# Altium project KeetV2.PrjPCB (part 2 of 6)
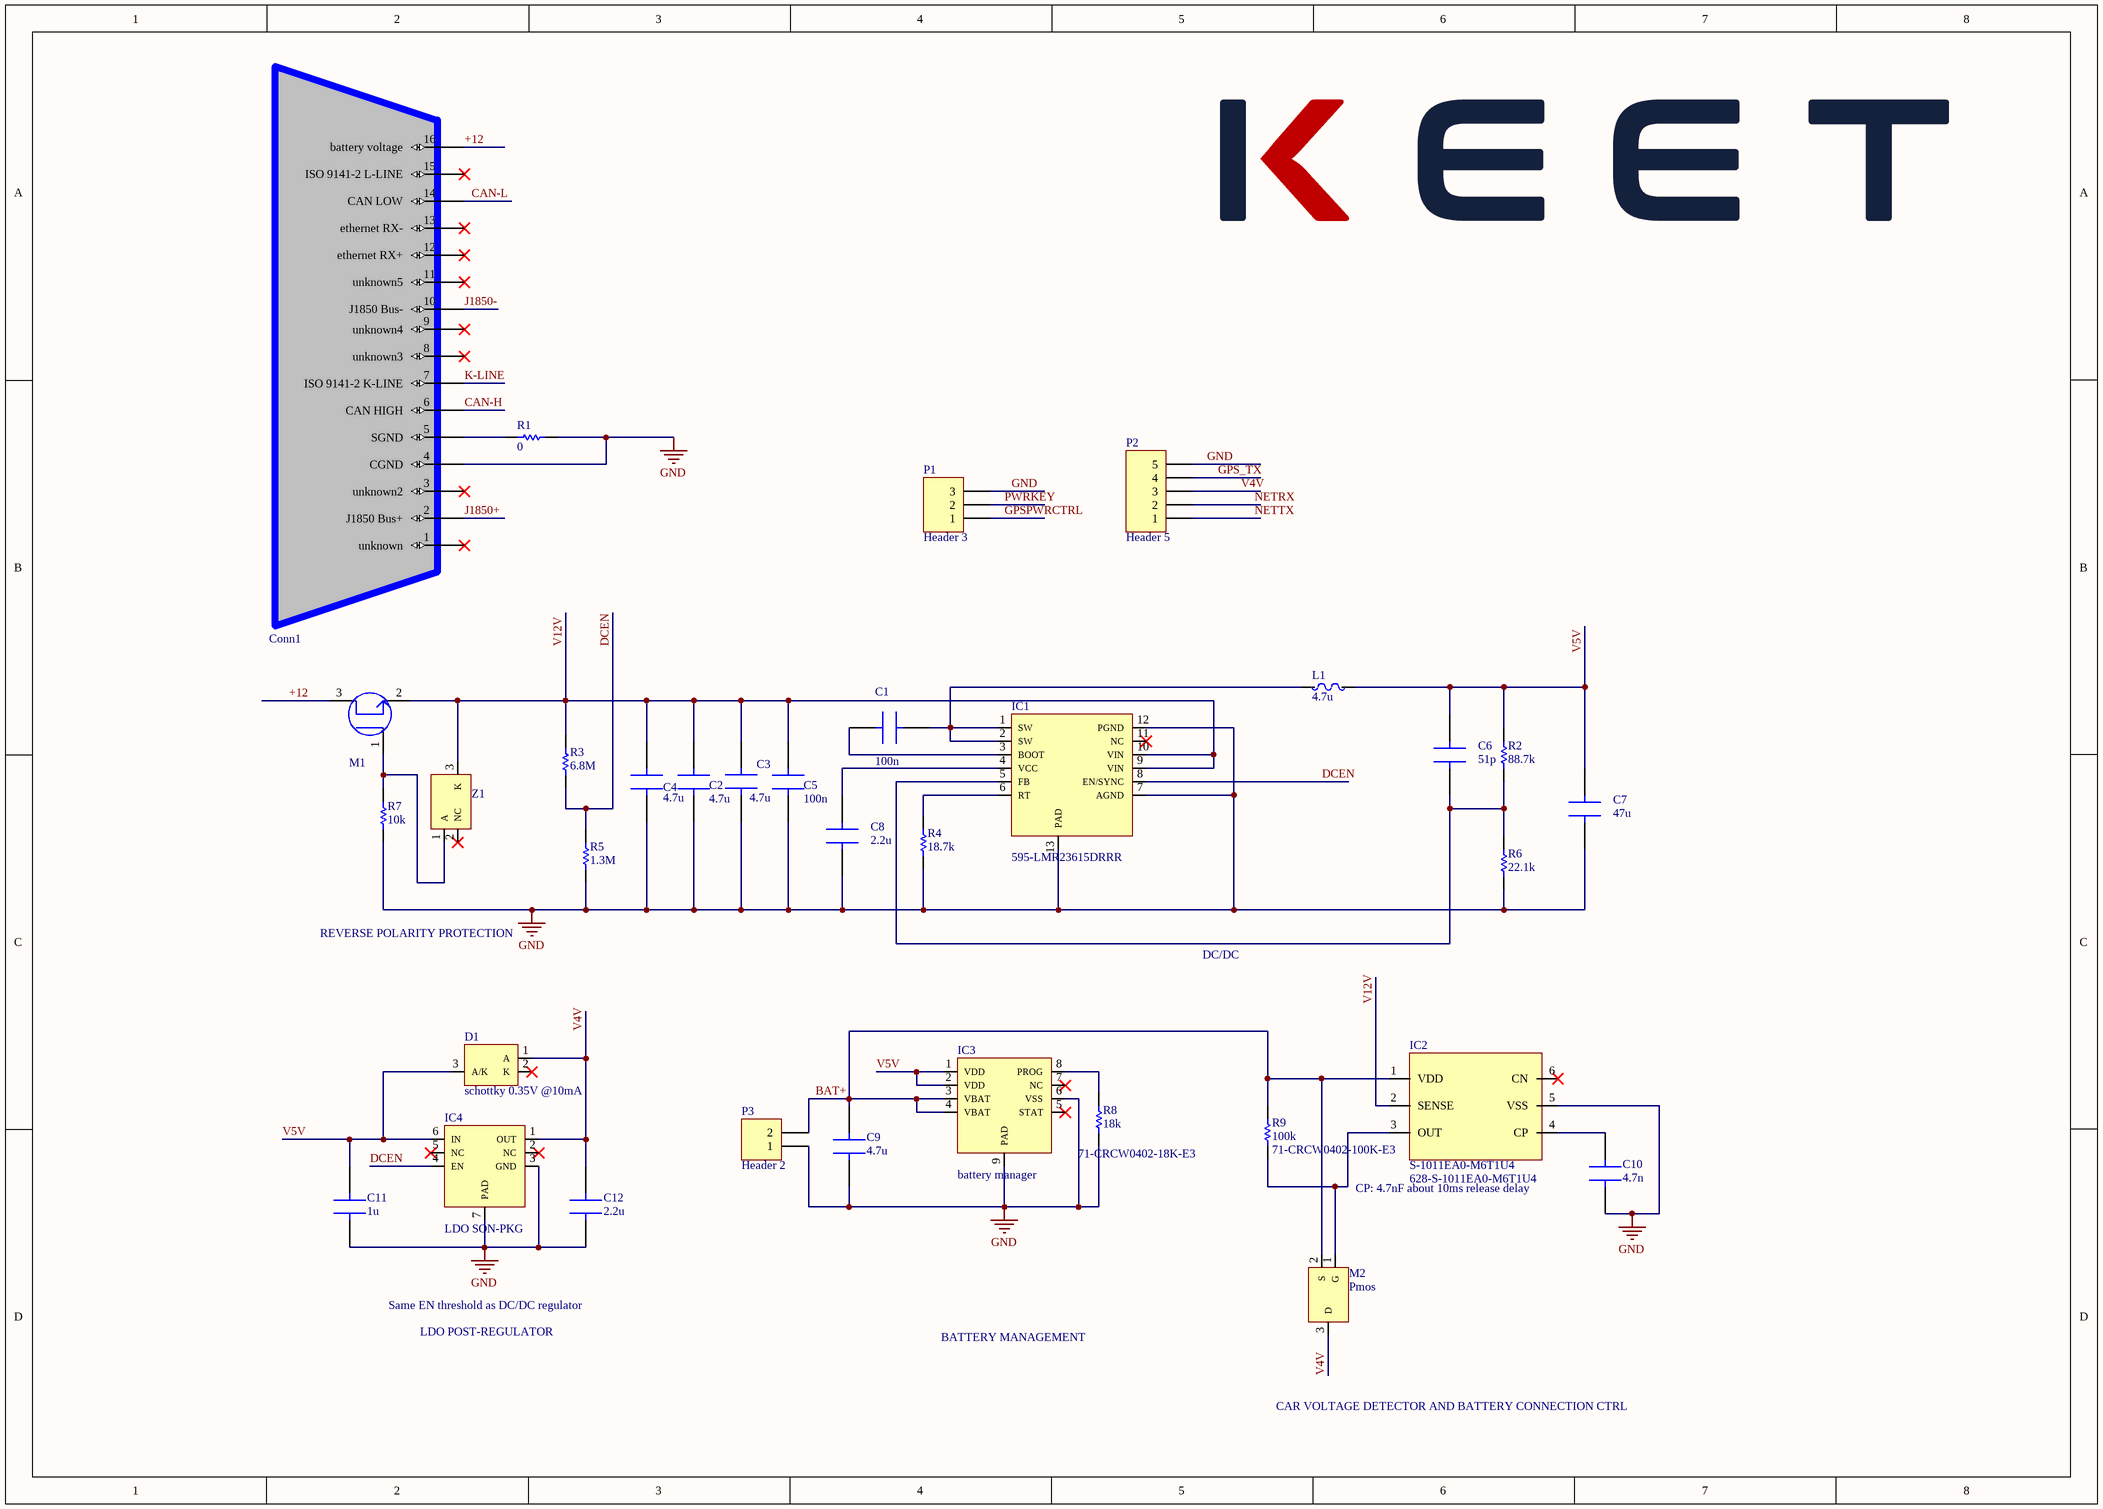
[diagram p3: PowerSupply.SchDoc]

## Sheet PowerSupply.SchDoc (continued)
### Library data of the parts
C1 = GRM155R71C104KA88D: CAP CER 0.1UF 16V X7R 0402; Manufacturer: Murata; Material: Ceramic; Capacitance: 100nF; Tolerance: 10%; Insulation Resistance: 10GR; Supplier 1: Mouser; Manufacturer Part Number: GRM155R71C104KA88D; RoHS: Yes; Category: Ceramic Capacitors; Stock 1: 8059685; Pricing 1: 1=0,10000, 10=0,01200, 50=0,01200, 100=0,01000, 1000=0,00600, 10000=0,00300 (USD); Mount: Surface Mount; Case/Package: 0402; Number of Pins: 2; Case Code (Metric): 1005; Case Code (Imperial): 0402; Dielectric Material: Ceramic; Min Operating Temperature: -55°C; Max Operating Temperature: 125°C; Dielectric: X7R; Voltage Rating: 16V; Packaging: Tape and Reel; Voltage Rating (DC): 16V; Package Quantity: 1; Termination: SMD/SMT; Voltage: 16V; Length: 1mm; Width: 0.5mm; Height: 0.5mm; Thickness: 0.022inch; Depth: 0.5mm; Radiation Hardening: No; REACH SVHC: No SVHC; Lead Free: Lead Free; RoHS Compliant: Yes; ComponentLink1URL: https://datasheet.ciiva.com/18102/getdatasheetpartid-85307-18102905.pdf?src-supplier=Verical; ComponentLink1Description: https://datasheet.ciiva.com/18102/getdatasheetpartid-85307-18102905.pdf?src-supplier=Verical; ComponentLink2URL: https://datasheet.ciiva.com/129/grm155r71c104ka88-01-129739.pdf?src-supplier=Digi-Key; ComponentLink2Description: https://datasheet.ciiva.com/129/grm155r71c104ka88-01-129739.pdf?src-supplier=Digi-Key; ComponentLink3URL: https://datasheet.ciiva.com/129/grm155r71c104ka88-01-129740.pdf?src-supplier=Digi-Key; ComponentLink3Description: https://datasheet.ciiva.com/129/grm155r71c104ka88-01-129740.pdf?src-supplier=Digi-Key; ComponentLink4URL: https://datasheet.ciiva.com/29199/454098-da-01-en-vs-kondensator-0402-29199799.pdf?src-supplier=Conrad; ComponentLink4Description: https://datasheet.ciiva.com/29199/454098-da-01-en-vs-kondensator-0402-29199799.pdf?src-supplier=Conrad; ComponentLink5URL: https://datasheet.ciiva.com/28534/4360-28534133.pdf?src-supplier=Element14; ComponentLink5Description: https://datasheet.ciiva.com/28534/4360-28534133.pdf?src-supplier=Element14; ComponentLink6URL: https://datasheet.ciiva.com/14103/grmseries-highdielectrictype-eng-14103750.pdf?src-supplier=Distrelec; ComponentLink6Description: https://datasheet.ciiva.com/14103/grmseries-highdielectrictype-eng-14103750.pdf?src-supplier=Distrelec; ComponentLink7URL: https://datasheet.ciiva.com/16199/product-16199000.pdf?src-supplier=Future+Electronics; ComponentLink7Description: https://datasheet.ciiva.com/16199/product-16199000.pdf?src-supplier=Future+Electronics; ComponentLink8URL: https://datasheet.ciiva.com/14116/grmseries-highdielectrictype-eng-14116878.pdf?src-supplier=Distrelec; ComponentLink8Description: https://datasheet.ciiva.com/14116/grmseries-highdielectrictype-eng-14116878.pdf?src-supplier=Distrelec; ComponentLink9URL: https://datasheet.ciiva.com/7937/4360-7937615.pdf?src-supplier=Element14; ComponentLink9Description: https://datasheet.ciiva.com/7937/4360-7937615.pdf?src-supplier=Element14; ComponentLink10URL: https://datasheet.ciiva.com/28534/4360-28534127.pdf?src-supplier=Element14; ComponentLink10Description: https://datasheet.ciiva.com/28534/4360-28534127.pdf?src-supplier=Element14; Supplier Part Number 1: 81-GRM155R71C104KA88
C2-C4 = TMK107BBJ475MA-T: Cap Ceramic 4.7uF 25V X5R 20% SMD 0603 85°C Paper T/R; Manufacturer: Taiyo Yuden; Supplier 1: Mouser; Manufacturer Part Number: TMK107BBJ475MA-T; RoHS: Yes; Category: Ceramic Capacitors; Stock 1: 24308; Pricing 1: 1=0,35000, 10=0,15700, 50=0,15700, 100=0,10600, 1000=0,08200, 10000=0,06300 (USD); Mount: Surface Mount; Case/Package: 0603; Min Operating Temperature: -55°C; Max Operating Temperature: 85°C; Packaging: Tape and Reel; Capacitance: 4.7uF; Tolerance: 20%; Voltage Rating: 25V; RoHS Compliant: Yes; ComponentLink1URL: https://ds.yuden.co.jp/TYCOMPAS/ut/detail?pn=TMK107BBJ475MA-T &amp;u=M&src-supplier=Digi-Key; ComponentLink1Description: https://ds.yuden.co.jp/TYCOMPAS/ut/detail?pn=TMK107BBJ475MA-T &amp;u=M&src-supplier=Digi-Key; Supplier Part Number 1: 963-TMK107BBJ475MA-T
C5 = C1005X5R1H104K050BB: CAP CER 0.1UF 50V X5R 0402; Manufacturer: TDK; Dielectric Material: Ceramic; Capacitance: 100nF; Tolerance: 10%; Supplier 1: Mouser; Manufacturer Part Number: C1005X5R1H104K050BB; RoHS: Yes; Category: Ceramic Capacitors; Stock 1: 364267; Pricing 1: 1=0,12000, 10=0,04700, 50=0,04700, 100=0,03200, 1000=0,02200, 10000=0,01400 (USD); Mount: Surface Mount; Case/Package: 0402; Case Code (Metric): 1005; Case Code (Imperial): 0402; Weight: 2.3E-05oz; Min Operating Temperature: -55°C; Max Operating Temperature: 85°C; Dielectric: X5R; Voltage Rating: 50V; Packaging: Tape and Reel; Voltage Rating (DC): 50V; Termination: SMD/SMT; Package Quantity: 1; Resistor Type: Ceramic; Voltage: 50V; Series: C; Construction: Flat; Length: 1mm; Width: 0.02inch; Height: 0.5mm; Depth: 0.5mm; Thickness: 0.022inch; Radiation Hardening: No; Lead Free: Lead Free; REACH SVHC: No SVHC; RoHS Compliant: Yes; ComponentLink1URL: https://datasheet.ciiva.com/26946/getdatasheetpartid-743571-26946503.pdf?src-supplier=Verical; ComponentLink1Description: https://datasheet.ciiva.com/26946/getdatasheetpartid-743571-26946503.pdf?src-supplier=Verical; ComponentLink2URL: https://datasheet.ciiva.com/6292/tdkmlcccaprange-6292486.pdf?src-supplier=Digi-Key; ComponentLink2Description: https://datasheet.ciiva.com/6292/tdkmlcccaprange-6292486.pdf?src-supplier=Digi-Key; ComponentLink3URL: https://datasheet.ciiva.com/16494/e413-c-16494264.pdf?src-supplier=Future+Electronics; ComponentLink3Description: https://datasheet.ciiva.com/16494/e413-c-16494264.pdf?src-supplier=Future+Electronics; ComponentLink4URL: https://datasheet.ciiva.com/17487/e412-c-17487567.pdf?src-supplier=Avnet+Europe; ComponentLink4Description: https://datasheet.ciiva.com/17487/e412-c-17487567.pdf?src-supplier=Avnet+Europe; Supplier Part Number 1: 810-C1005X5R1H104K
C6 = GRM1555C1H510JA01D: CAP CER 51PF 50V C0G/NP0 0402; Manufacturer: Murata; Tolerance: 5%; Dielectric: C0G; Supplier 1: Mouser; Manufacturer Part Number: GRM1555C1H510JA01D; RoHS: Yes; Category: Ceramic Capacitors; Stock 1: 25277; Pricing 1: 1=0,10000, 10=0,06000, 50=0,06000, 100=0,02600, 1000=0,01400, 10000=0,01100 (USD); Mount: Surface Mount; Case/Package: 0402; Case Code (Metric): 1005; Case Code (Imperial): 0402; Min Operating Temperature: -55°C; Max Operating Temperature: 125°C; Capacitance: 51pF; Packaging: Tape and Reel; Voltage Rating: 50V; Package Quantity: 10000; Voltage Rating (DC): 50V; Termination: SMD/SMT; Voltage: 50V; Length: 1mm; Width: 0.02inch; Height: 0.5mm; Thickness: 0.022inch; Depth: 0.5mm; Radiation Hardening: No; Lead Free: Lead Free; ComponentLink1URL: https://datasheet.ciiva.com/11606/product-11606259.pdf?src-supplier=Avnet; ComponentLink1Description: https://datasheet.ciiva.com/11606/product-11606259.pdf?src-supplier=Avnet; ComponentLink2URL: https://datasheet.ciiva.com/6263/grm1555c1h510ja01-01-6263865.pdf?src-supplier=Digi-Key; ComponentLink2Description: https://datasheet.ciiva.com/6263/grm1555c1h510ja01-01-6263865.pdf?src-supplier=Digi-Key; ComponentLink3URL: https://datasheet.ciiva.com/6263/partnumbering-e-01-6263868.pdf?src-supplier=Digi-Key; ComponentLink3Description: https://datasheet.ciiva.com/6263/partnumbering-e-01-6263868.pdf?src-supplier=Digi-Key; ComponentLink4URL: https://datasheet.ciiva.com/6263/partnumbering-e-01-6263870.pdf?src-supplier=Digi-Key; ComponentLink4Description: https://datasheet.ciiva.com/6263/partnumbering-e-01-6263870.pdf?src-supplier=Digi-Key; Supplier Part Number 1: 81-GRM1555C1H510JA1D
C7 = GRM31CR61A476KE15L: Multilayer Ceramic Capacitors MLCC - SMD/SMT 1206 47uF 10Vdc X5R +/-10%; Manufacturer: Murata; Voltage: 10V; Tolerance: 10%; Supplier 1: Mouser; Manufacturer Part Number: GRM31CR61A476KE15L; RoHS: Yes; Category: Ceramic Capacitors; Stock 1: 61980; Pricing 1: 1=0,67000, 10=0,40500, 50=0,40500, 100=0,35300, 1000=0,23900, 10000=0,19100 (USD); Mount: Surface Mount; Case/Package: 1206; Material: Ceramic; Case Code (Metric): 3216; Case Code (Imperial): 1206; Min Operating Temperature: -55°C; Max Operating Temperature: 85°C; Termination: SMD/SMT; Dielectric: X5R; Package Quantity: 2000; Packaging: Tape and Reel; Capacitance: 47uF; Voltage Rating: 10V; Voltage Rating (DC): 10V; Length: 3.2mm; Width: 1.6mm; Height: 1.6mm; Thickness: 0.071inch; Depth: 1.6mm; Lead Free: Lead Free; REACH SVHC: No SVHC; ComponentLink1URL: https://datasheet.ciiva.com/29536/grm31cr61a476ke15-01-29536840.pdf?src-supplier=Digi-Key; ComponentLink1Description: https://datasheet.ciiva.com/29536/grm31cr61a476ke15-01-29536840.pdf?src-supplier=Digi-Key; ComponentLink2URL: https://datasheet.ciiva.com/13337/product-13337807.pdf?src-supplier=Mouser; ComponentLink2Description: https://datasheet.ciiva.com/13337/product-13337807.pdf?src-supplier=Mouser; ComponentLink3URL: https://datasheet.ciiva.com/46445/1769893-46445004.pdf?src-supplier=Element14; ComponentLink3Description: https://datasheet.ciiva.com/46445/1769893-46445004.pdf?src-supplier=Element14; ComponentLink4URL: https://datasheet.ciiva.com/41860/partnumbering-e-01-41860758.pdf?src-supplier=Digi-Key; ComponentLink4Description: https://datasheet.ciiva.com/41860/partnumbering-e-01-41860758.pdf?src-supplier=Digi-Key; ComponentLink5URL: https://datasheet.ciiva.com/46445/1769893-46445005.pdf?src-supplier=Element14; ComponentLink5Description: https://datasheet.ciiva.com/46445/1769893-46445005.pdf?src-supplier=Element14; Supplier Part Number 1: 81-GRM31CR61A476KE5L
C8 = CL10A225KP8NNNC: SAMSUNG ELECTRO-MECHANICS - CL10A225KP8NNNC - SMD Multilayer Ceramic Capacitor, 2.2 µF, 10 V, 0603 [1608 Metric], ± 10%, X5R, CL Series; Capacitance: 2.2uF; Voltage Rating: 10V; Supplier 1: Mouser; Manufacturer: Samsung; Manufacturer Part Number: CL10A225KP8NNNC; RoHS: Yes; Category: Ceramic Capacitors; Stock 1: 629992; Pricing 1: 1=0,10000, 10=0,03100, 50=0,03100, 100=0,02500, 1000=0,01400, 10000=0,00900 (USD); Mount: Surface Mount; Case/Package: 0603; Case Code (Metric): 1608; Case Code (Imperial): 0603; Material: Ceramic; Min Operating Temperature: -55°C; Max Operating Temperature: 85°C; Tolerance: 10%; Dielectric: X5R; Package Quantity: 1; Packaging: Tape and Reel; Voltage: 10V; Series: CL; Construction: Flat; Voltage Rating (DC): 10V; Length: 1.6mm; Width: 0.031inch; Height: 0.8mm; Thickness: 0.035inch; Depth: 0.8mm; Radiation Hardening: No; RoHS Compliant: Yes; Lead Free: Lead Free; ComponentLink1URL: https://datasheet.ciiva.com/25799/cl10a225kp8nnnc-25799697.pdf?src-supplier=Digi-Key; ComponentLink1Description: https://datasheet.ciiva.com/25799/cl10a225kp8nnnc-25799697.pdf?src-supplier=Digi-Key; ComponentLink2URL: https://datasheet.ciiva.com/26838/getdatasheetpartid-358617-26838359.pdf?src-supplier=Verical; ComponentLink2Description: https://datasheet.ciiva.com/26838/getdatasheetpartid-358617-26838359.pdf?src-supplier=Verical; ComponentLink3URL: https://datasheet.ciiva.com/29198/457945-da-01-en-vs-kondensator-0603-29198592.pdf?src-supplier=Conrad; ComponentLink3Description: https://datasheet.ciiva.com/29198/457945-da-01-en-vs-kondensator-0603-29198592.pdf?src-supplier=Conrad; Supplier Part Number 1: 187-CL10A225KP8NNNC
C9 = GRM155R60J475ME87D: MURATA - GRM155R60J475ME87D - SMD Multilayer Ceramic Capacitor, 4.7 µF, 6.3 V, 0402 [1005 Metric], ± 20%, X5R, GRM Series; Capacitance: 4.7uF; Voltage Rating: 6.3V; Supplier 1: Mouser; Manufacturer: Murata; Manufacturer Part Number: GRM155R60J475ME87D; RoHS: Yes; Category: Ceramic Capacitors; Stock 1: 1169227; Pricing 1: 1=0,14000, 10=0,05800, 50=0,05800, 100=0,04800, 1000=0,02800, 10000=0,02000 (USD); Mount: Surface Mount; Case/Package: 0402; Case Code (Metric): 1005; Case Code (Imperial): 0402; Min Operating Temperature: -55°C; Max Operating Temperature: 85°C; Tolerance: 20%; Dielectric: X5R; Package Quantity: 1; Packaging: Tape and Reel; Voltage: 6.3V; Voltage Rating (DC): 6.3V; Series: GRM; Construction: Flat; Length: 1mm; Width: 0.02inch; Height: 0.5mm; Thickness: 0.022inch; Depth: 0.5mm; Radiation Hardening: No; REACH SVHC: No SVHC; Lead Free: Lead Free; RoHS Compliant: Yes; ComponentLink1URL: https://datasheet.ciiva.com/3779/21116grm155r60j475me8723-3779229.pdf?src-supplier=Arrow+Electronics; ComponentLink1Description: https://datasheet.ciiva.com/3779/21116grm155r60j475me8723-3779229.pdf?src-supplier=Arrow+Electronics; ComponentLink2URL: https://datasheet.ciiva.com/136/partnumbering-e-01-136783.pdf?src-supplier=Digi-Key; ComponentLink2Description: https://datasheet.ciiva.com/136/partnumbering-e-01-136783.pdf?src-supplier=Digi-Key; ComponentLink3URL: https://datasheet.ciiva.com/136/partnumbering-e-01-136784.pdf?src-supplier=Digi-Key; ComponentLink3Description: https://datasheet.ciiva.com/136/partnumbering-e-01-136784.pdf?src-supplier=Digi-Key; Supplier Part Number 1: 81-GRM155R60J475ME8D
C10 = GRM155R71H472JA01J: Multilayer Ceramic Capacitors MLCC - SMD/SMT; Manufacturer: Murata; Dielectric: X7R; Capacitance: 4.7nF; Voltage Rating (DC): 50V; Tolerance: 5%; Supplier 1: Mouser; Manufacturer Part Number: GRM155R71H472JA01J; RoHS: Yes; Category: Ceramic Capacitors; Stock 1: 49652; Pricing 1: 1=0,10000, 10=0,03400, 50=0,03400, 100=0,01500, 1000=0,00900, 10000=0,00600 (USD); Case/Package: 0402; Case Code (Imperial): 0402; Case Code (Metric): 1005; Weight: 0.000212oz; Min Operating Temperature: -55°C; Max Operating Temperature: 125°C; Packaging: Tape and Reel; Termination: SMD/SMT; Package Quantity: 50000; Length: 1mm; Width: 0.5mm; Height: 0.5mm; Thickness: 500um; RoHS Compliant: Yes; ComponentLink1URL: http://www.mouser.com/ds/2/281/c02e-2905.pdf?src-supplier=Mouser; ComponentLink1Description: http://www.mouser.com/ds/2/281/c02e-2905.pdf?src-supplier=Mouser; Supplier Part Number 1: 81-GRM155R71H472JA1J
C11 = EMK105BJ105KVHF: TAIYO YUDEN - EMK105BJ105KVHF - CAPACITOR,CERAMIC,0402,16V,X5R,1 F, 10% ROHS COMPLIANT: YES; Capacitance: 1uF; Supplier 1: Mouser; Manufacturer: Taiyo Yuden; Manufacturer Part Number: EMK105BJ105KVHF; RoHS: Yes; Category: Ceramic Capacitors; Stock 1: 62407; Pricing 1: 1=0,10000, 10=0,06700, 50=0,06700, 100=0,02900, 1000=0,01500, 10000=0,01100 (USD); Mount: Surface Mount; Case/Package: 0402; Case Code (Metric): 1005; Case Code (Imperial): 0402; Weight: 2.3E-05oz; Min Operating Temperature: -55°C; Max Operating Temperature: 85°C; Voltage Rating: 16V; Package Quantity: 10000; Packaging: Tape and Reel; Tolerance: 10%; Dielectric: X5R; Termination: SMD/SMT; Voltage Rating (DC): 16V; Length: 0.039inch; Width: 0.5mm; Height: 0.5mm; Thickness: 0.022inch; Ratings: AEC-Q200; Lead Free: Lead Free; Halogen Free: Halogen Free; RoHS Compliant: Yes; ComponentLink1URL: http://www.mouser.com/ds/2/396/mlcc11_hq_e-541564.pdf?src-supplier=Mouser; ComponentLink1Description: http://www.mouser.com/ds/2/396/mlcc11_hq_e-541564.pdf?src-supplier=Mouser; ComponentLink2URL: http://www.yuden.co.jp/eu/product/category/capacitor/putpdf/EMK105BJ105KVHF.pdf?src-supplier=Avnet; ComponentLink2Description: http://www.yuden.co.jp/eu/product/category/capacitor/putpdf/EMK105BJ105KVHF.pdf?src-supplier=Avnet; ComponentLink3URL: https://www.yuden.co.jp/productdata/catalog/mlcc01_hq_e.pdf?src-supplier=Digi-Key; ComponentLink3Description: https://www.yuden.co.jp/productdata/catalog/mlcc01_hq_e.pdf?src-supplier=Digi-Key; ComponentLink4URL: http://ds.yuden.co.jp/TYCOMPAS/ut/detail.do?productNo=EMK105BJ105KVHF&fileName=EMK105BJ105KVHF_SS&mode=specSheetDownload&src-supplier=Digi-Key; ComponentLink4Description: http://ds.yuden.co.jp/TYCOMPAS/ut/detail.do?productNo=EMK105BJ105KVHF&fileName=EMK105BJ105KVHF_SS&mode=specSheetDownload&src-supplier=Digi-Key; ComponentLink5URL: http://www.farnell.com/datasheets/2819903.pdf?src-supplier=Newark; ComponentLink5Description: http://www.farnell.com/datasheets/2819903.pdf?src-supplier=Newark; Supplier Part Number 1: 963-EMK105BJ105KVHF
C12 = TMK105CBJ225KV-F: Multilayer Ceramic Capacitor 2.2uF 25V 10% 0402 Paper T/R; Manufacturer: Taiyo Yuden; Supplier 1: Mouser; Manufacturer Part Number: TMK105CBJ225KV-F; RoHS: Yes; Category: Ceramic Capacitors; Stock 1: 6971; Pricing 1: 1=0,24000, 10=0,09800, 50=0,09800, 100=0,06700, 1000=0,05000, 10000=0,03600 (USD); Lead Free: Lead Free; RoHS Compliant: Yes; ComponentLink1URL: http://www.farnell.com/datasheets/2801310.pdf?src-supplier=Farnell; ComponentLink1Description: http://www.farnell.com/datasheets/2801310.pdf?src-supplier=Farnell; ComponentLink2URL: http://www.farnell.com/datasheets/2801310.pdf?src-supplier=Newark; ComponentLink2Description: http://www.farnell.com/datasheets/2801310.pdf?src-supplier=Newark; ComponentLink3URL: http://www.farnell.com/datasheets/2801310.pdf?src-supplier=Element14; ComponentLink3Description: http://www.farnell.com/datasheets/2801310.pdf?src-supplier=Element14; ComponentLink4URL: https://ds.yuden.co.jp/TYCOMPAS/ut/detail?pn=TMK105CBJ225KV-F &amp;u=M&src-supplier=Digi-Key; ComponentLink4Description: https://ds.yuden.co.jp/TYCOMPAS/ut/detail?pn=TMK105CBJ225KV-F &amp;u=M&src-supplier=Digi-Key; Supplier Part Number 1: 963-TMK105CBJ225KV-F
D1 = BAT54CLT1G: Diode Schottky 30V 0.2A 3-Pin SOT-23 T/R; Manufacturer: ON Semiconductor; Forward Current: 200mA; Element Configuration: Common Cathode; Max Power Dissipation: 225mW; Recovery Time: 5ns; Max Reverse Leakage Current: 2uA; Peak Non-Repetitive Surge Current: 600mA; Capacitance: 10pF; Forward Voltage: 800mV; Supplier 1: Mouser; Manufacturer Part Number: BAT54CLT1G; RoHS: Yes; Category: Schottky Diodes; Stock 1: 184659; Pricing 1: 1=0,14000, 10=0,10500, 50=0,10500, 100=0,04100, 1000=0,02900, 10000=0,02200 (USD); Case/Package: SOT-23-3; Number of Pins: 3; Contact Plating: Tin,Matte; Min Operating Temperature: -55°C; Max Operating Temperature: 125°C; Packaging: Tape and Reel; Package Quantity: 3000; Average Rectified Current: 200mA; Reverse Recovery Time: 5ns; Max Repetitive Reverse Voltage (Vrrm): 30V; Max Forward Surge Current (Ifsm): 600mA; Current Rating: 200mA; Voltage Rating (DC): 30V; Max Reverse Voltage (DC): 30V; Max Surge Current: 600mA; Max Reverse Current: 2uA; Power Dissipation: 225mW; Length: 3.04mm; Width: 1.4mm; Height: 1.01mm; Radiation Hardening: No; Lead Free: Lead Free; Halogen Free: Halogen Free; REACH SVHC: No SVHC; ComponentLink1URL: https://datasheet.ciiva.com/1240/bat54clt1-d-1240707.pdf?src-supplier=Newark; ComponentLink1Description: https://datasheet.ciiva.com/1240/bat54clt1-d-1240707.pdf?src-supplier=Newark; ComponentLink2URL: https://datasheet.ciiva.com/34301/885769-34301654.pdf?src-supplier=Jameco; ComponentLink2Description: https://datasheet.ciiva.com/34301/885769-34301654.pdf?src-supplier=Jameco; ComponentLink3URL: https://datasheet.ciiva.com/30479/0900766b8121b932-30479128.pdf?src-supplier=RSComponents; ComponentLink3Description: https://datasheet.ciiva.com/30479/0900766b8121b932-30479128.pdf?src-supplier=RSComponents; ComponentLink4URL: https://datasheet.ciiva.com/15144/getdatasheetpartid-98336-15144809.pdf?src-supplier=Verical; ComponentLink4Description: https://datasheet.ciiva.com/15144/getdatasheetpartid-98336-15144809.pdf?src-supplier=Verical; ComponentLink5URL: https://datasheet.ciiva.com/22659/1918740-22659014.pdf?src-supplier=Element14; ComponentLink5Description: https://datasheet.ciiva.com/22659/1918740-22659014.pdf?src-supplier=Element14; ComponentLink6URL: https://datasheet.ciiva.com/1180/bat54clt1-d-1180247.pdf?src-supplier=Element14; ComponentLink6Description: https://datasheet.ciiva.com/1180/bat54clt1-d-1180247.pdf?src-supplier=Element14; ComponentLink7URL: https://datasheet.ciiva.com/1180/bat54clt1-d-1180248.pdf?src-supplier=Element14; ComponentLink7Description: https://datasheet.ciiva.com/1180/bat54clt1-d-1180248.pdf?src-supplier=Element14; ComponentLink8URL: https://datasheet.ciiva.com/16205/bat54clt1-d-16205033.pdf?src-supplier=Future+Electronics; ComponentLink8Description: https://datasheet.ciiva.com/16205/bat54clt1-d-16205033.pdf?src-supplier=Future+Electronics; ComponentLink9URL: https://datasheet.ciiva.com/905/bat54clt1-d-905835.pdf?src-supplier=Digi-Key; ComponentLink9Description: https://datasheet.ciiva.com/905/bat54clt1-d-905835.pdf?src-supplier=Digi-Key; ComponentLink10URL: https://datasheet.ciiva.com/28655/bat54clt1-d-28655787.pdf?src-supplier=Element14; ComponentLink10Description: https://datasheet.ciiva.com/28655/bat54clt1-d-28655787.pdf?src-supplier=Element14; ComponentLink11URL: https://datasheet.ciiva.com/8294/bat54clt1-d-8294495.pdf?src-supplier=Avnet; ComponentLink11Description: https://datasheet.ciiva.com/8294/bat54clt1-d-8294495.pdf?src-supplier=Avnet; Supplier Part Number 1: 863-BAT54CLT1G
IC1 = LMR23615DRRR: SIMPLE SWITCHER®, 36-V, 1.5-A Synchronous Step-Down Converter 12-SON -40 to 125; Manufacturer: Texas Instruments; Output Type: Adjustable; Output Configuration: Positive; Number of Outputs: 1; Min Input Voltage: 4V; Max Input Voltage: 36V; Min Output Voltage: 1V; Max Output Voltage: 28V; Output Current: 1.5A; Switching Frequency: 2.425MHz; Synchronous Rectifier: Yes; Supplier 1: Mouser; Manufacturer Part Number: LMR23615DRRR; RoHS: Yes; Category: Voltage Regulators - Switching; Stock 1: 2047; Pricing 1: 1=3,04000, 10=2,73000, 50=2,58000, 100=2,12000, 1000=1,53000, 10000=1,47000 (USD); Mount: Surface Mount; Min Operating Temperature: -40°C; Max Operating Temperature: 125°C; Features: UVLO; Packaging: Tape and Reel; RoHS Compliant: Yes; ComponentLink1URL: http://www.ti.com/lit/ds/symlink/lmr23615.pdf?src-supplier=Digi-Key; ComponentLink1Description: http://www.ti.com/lit/ds/symlink/lmr23615.pdf?src-supplier=Digi-Key
IC2 = S-1011EA0-M6T1U4: Voltage detector; Manufacturer: ABLIC U.S.A.; Reset: Active Low; Number of Voltages Monitored: 1; Threshold Voltage: 10V; Supplier 1: Mouser; Manufacturer Part Number: S-1011EA0-M6T1U4; RoHS: No; Category: Voltage Supervisors; Stock 1: 20; Pricing 1: 1=0,99000, 10=0,88300, 50=0,88300, 100=0,60400, 1000=0,41900, 10000=0,37000 (USD); Mount: Surface Mount; Case/Package: SOT-23-6; Min Operating Temperature: -40°C; Max Operating Temperature: 85°C; Type: Voltage Detector; Packaging: Tape and Reel; ComponentLink1URL: https://www.ablic.com/en/doc/datasheet/voltage_detector/S1011_E.pdf?src-supplier=Digi-Key; ComponentLink1Description: https://www.ablic.com/en/doc/datasheet/voltage_detector/S1011_E.pdf?src-supplier=Digi-Key
IC3 = MCP73831T-2ACI/MC: IC CONTROLLER LI-ION 4.2V 8DFN; Manufacturer: Microchip; Output Current: 500mA; Max Input Voltage: 7V; Number of Channels: 1; Min Supply Voltage: 3.75V; Max Supply Voltage: 6V; Operating Supply Current: 510uA; Supplier 1: Mouser; Manufacturer Part Number: MCP73831T-2ACI/MC; RoHS: Yes; Category: Battery Management; Stock 1: 5377; Pricing 1: 1=0,62000, 10=0,62000, 50=0,51000, 100=0,47000, 1000=0,47000, 10000=0,47000 (USD); Mount: Surface Mount; Case/Package: DFN; Number of Pins: 8; Contact Plating: Tin,Matte; Min Operating Temperature: -40°C; Max Operating Temperature: 85°C; Output Voltage: 4.2V; Packaging: Tape and Reel; Package Quantity: 3300; Series: MCP73831; Radiation Hardening: No; Lead Free: Lead Free; RoHS Compliant: Yes; ComponentLink1URL: https://datasheet.ciiva.com/16466/21984e-16466086.pdf?src-supplier=Avnet+Asia; ComponentLink1Description: https://datasheet.ciiva.com/16466/21984e-16466086.pdf?src-supplier=Avnet+Asia; ComponentLink2URL: https://datasheet.ciiva.com/1933/21984e-1933405.pdf?src-supplier=Digi-Key; ComponentLink2Description: https://datasheet.ciiva.com/1933/21984e-1933405.pdf?src-supplier=Digi-Key; Supplier Part Number 1: 579-MCP73831T-2ACIMC
IC4 = TLV75740PDRVR: 1-A, low-IQ, high-accuracy, low-dropout voltage regulator with enable 6-WSON -40 to 125; Manufacturer: Texas Instruments; Supplier 1: Mouser; Manufacturer Part Number: TLV75740PDRVR; RoHS: Yes; Category: Integrated Circuits (ICs); Stock 1: 5343; Pricing 1: 1=0,62000, 10=0,49000, 50=0,49000, 100=0,36400, 1000=0,21700, 10000=0,18000 (USD); Min Operating Temperature: -40°C; Max Operating Temperature: 125°C; RoHS Compliant: Yes; ComponentLink1URL: http://www.ti.com/general/docs/suppproductinfo.tsp?distId=10&amp;gotoUrl=http%3A%2F%2Fwww.ti.com%2Flit%2Fgpn%2Ftlv757p&src-supplier=Digi-Key; ComponentLink1Description: http://www.ti.com/general/docs/suppproductinfo.tsp?distId=10&amp;gotoUrl=http%3A%2F%2Fwww.ti.com%2Flit%2Fgpn%2Ftlv757p&src-supplier=Digi-Key; Supplier Part Number 1: 595-TLV75740PDRVR
L1 = IFSC1515AHER4R7M01: Inductor Power Shielded Wirewound 4.7uH 20% 100KHz 2.2A 90mOhm DCR 1515 T/R; Manufacturer: Vishay Dale; Saturation Current: 2A; DC Resistance (DCR): 90mR; Supplier 1: Mouser; Manufacturer Part Number: IFSC1515AHER4R7M01; RoHS: Yes; Category: Fixed Inductors; Stock 1: 16855; Pricing 1: 1=0,64000, 10=0,55900, 50=0,55900, 100=0,33500, 1000=0,26800, 10000=0,20300 (USD); Mount: Surface Mount; Case/Package: 1515; Number of Pins: 2; Min Operating Temperature: -55°C; Max Operating Temperature: 125°C; Inductance Tolerance: 20%; Package Quantity: 2000; Current Rating: 2.2A; Tolerance: 20%; Shielding: Shielded; Packaging: Tape and Reel; Inductance: 4.7uH; Test Frequency: 100kHz; Max DC Current: 2A; Termination: SMD/SMT; RMS Current (Irms): 2.2A; Series: IFSC-1515AH-01; Length: 0.15inch; Width: 0.15inch; Height: 1.8mm; Height - Seated (Max): 0.075inch; Depth: 4mm; REACH SVHC: Unknown; Military Standard: Not; Lead Free: Lead Free; RoHS Compliant: Yes; ComponentLink1URL: https://datasheet.ciiva.com/1049/sc15ah01-1049410.pdf?src-supplier=Digi-Key; ComponentLink1Description: https://datasheet.ciiva.com/1049/sc15ah01-1049410.pdf?src-supplier=Digi-Key; ComponentLink2URL: https://datasheet.ciiva.com/1049/sc15ah01-1049411.pdf?src-supplier=Digi-Key; ComponentLink2Description: https://datasheet.ciiva.com/1049/sc15ah01-1049411.pdf?src-supplier=Digi-Key; ComponentLink3URL: https://datasheet.ciiva.com/1049/sc15ah01-1049412.pdf?src-supplier=Digi-Key; ComponentLink3Description: https://datasheet.ciiva.com/1049/sc15ah01-1049412.pdf?src-supplier=Digi-Key; ComponentLink4URL: https://datasheet.ciiva.com/46395/1913058-46395302.pdf?src-supplier=Element14; ComponentLink4Description: https://datasheet.ciiva.com/46395/1913058-46395302.pdf?src-supplier=Element14; ComponentLink5URL: https://datasheet.ciiva.com/8494/sc15ah01-8494793.pdf?src-supplier=Avnet; ComponentLink5Description: https://datasheet.ciiva.com/8494/sc15ah01-8494793.pdf?src-supplier=Avnet; ComponentLink6URL: https://datasheet.ciiva.com/8017/sc15ah01-8017548.pdf?src-supplier=Element14; ComponentLink6Description: https://datasheet.ciiva.com/8017/sc15ah01-8017548.pdf?src-supplier=Element14; ComponentLink7URL: https://datasheet.ciiva.com/22726/1730404-22726061.pdf?src-supplier=Element14; ComponentLink7Description: https://datasheet.ciiva.com/22726/1730404-22726061.pdf?src-supplier=Element14; Supplier Part Number 1: 70-IFSC1515AHER4R7M0
M1 = DMPH6250SQ-7: DMPH6250SQ Series 60 V 2.4 A P-Channel Enhancement Mode Mosfet - SOT-23-3; Manufacturer: Diodes; Supplier 1: Mouser; Manufacturer Part Number: DMPH6250SQ-7; RoHS: Yes; Pricing 1: 1=0,40000, 10=0,31900, 50=0,31900, 100=0,22500, 1000=0,15100, 10000=0,13000 (USD); Supplier Part Number 1: 621-DMPH6250SQ-7
M2 = DMP1045U-7: P-Channel 12 V 31 mOhm Surface Mount Enhancement Mode Mosfet - SOT-23-3; Manufacturer: Diodes; Rise Time: 23.3ns; Continuous Drain Current (ID): 4A; Gate to Source Voltage (Vgs): 8V; Fall Time: 106.9ns; Turn-Off Delay Time: 91.2ns; Turn-On Delay Time: 15.7ns; Rds On Max: 31mR; Input Capacitance: 1.357nF; Drain to Source Voltage (Vdss): 12V; Max Power Dissipation: 800mW; Number of Elements: 1; Power Dissipation: 1.3W; Element Configuration: Single; Drain to Source Breakdown Voltage: -12V; Supplier 1: Mouser; Manufacturer Part Number: DMP1045U-7; RoHS: Yes; Category: MOSFETs; Stock 1: 8272; Pricing 1: 1=0,41000, 10=0,27800, 50=0,27800, 100=0,14500, 1000=0,10100, 10000=0,07800 (USD); Mount: Surface Mount; Case/Package: SOT-23; Number of Pins: 3; Weight: 0.000282oz; Contact Plating: Tin,Matte; Min Operating Temperature: -55°C; Max Operating Temperature: 150°C; Package Quantity: 3000; Packaging: Tape and Reel; Drain to Source Resistance: 31mR; Number of Channels: 1; Polarity: P-CHANNEL; Series: DMP1045; Length: 3mm; Width: 1.4mm; Height: 1.1mm; Radiation Hardening: No; REACH SVHC: No SVHC; Lead Free: Lead Free; RoHS Compliant: Yes; ComponentLink1URL: https://datasheet.ciiva.com/11176/dmp1045u-11176581.pdf?src-supplier=Avnet; ComponentLink1Description: https://datasheet.ciiva.com/11176/dmp1045u-11176581.pdf?src-supplier=Avnet; ComponentLink2URL: https://datasheet.ciiva.com/17323/dmp1045u-17323644.pdf?src-supplier=Avnet+Europe; ComponentLink2Description: https://datasheet.ciiva.com/17323/dmp1045u-17323644.pdf?src-supplier=Avnet+Europe; ComponentLink3URL: https://datasheet.ciiva.com/18648/dmp1045u-18648300.pdf?src-supplier=Digi-Key; ComponentLink3Description: https://datasheet.ciiva.com/18648/dmp1045u-18648300.pdf?src-supplier=Digi-Key; Supplier Part Number 1: 621-DMP1045U-7
P1 = Header 3: Header, 3-Pin; System: Connector; LatestRevisionDate: 17-Jul-2002; LatestRevisionNote: Re-released for DXP Platform.; Publisher: Altium Limited
P2 = Header 5: Header, 5-Pin; System: Connector; LatestRevisionDate: 17-Jul-2002; LatestRevisionNote: Re-released for DXP Platform.; Publisher: Altium Limited
P3 = Header 2: Header, 2-Pin; LatestRevisionDate: 17-Jul-2002; LatestRevisionNote: Re-released for DXP Platform.; Publisher: Altium Limited
R1 = RC0603JR-130RL: YAGEO - RC0603JR-130RL - RES, THICK FILM, 0R, 0.1W, 0603; Resistance: 0mR; Power Rating: 100mW; Voltage Rating: 50V; Tolerance: 1%; Temperature Coefficient: 200ppm/°C; Supplier 1: Mouser; Manufacturer: Yageo; Manufacturer Part Number: RC0603JR-130RL; RoHS: Yes; Category: Chip SMD Resistors; Stock 1: 5989; Pricing 1: 1=0,10000, 10=0,01500, 50=0,01500, 100=0,00500, 1000=0,00500, 10000=0,00500 (USD); Case/Package: 0603; Number of Pins: 2; Case Code (Imperial): 0603; Case Code (Metric): 1608; Contact Plating: Tin,Matte; Size Code: 0603; Min Operating Temperature: -55°C; Max Operating Temperature: 155°C; Packaging: Tape and Reel; Package Quantity: 5000; Resistor Type: Thick Film; Termination: SMD/SMT; Voltage Rating (DC): 50V; Series: RC; Construction: Rectangular; Length: 1.6mm; Width: 0.8mm; Height: 0.45mm; Depth: 0.8mm; Radiation Hardening: No; REACH SVHC: No SVHC; Military Standard: Not; Lead Free: Lead Free; RoHS Compliant: Yes; ComponentLink1URL: https://datasheet.ciiva.com/7983/443971-7983749.pdf?src-supplier=Element14; ComponentLink1Description: https://datasheet.ciiva.com/7983/443971-7983749.pdf?src-supplier=Element14; ComponentLink2URL: https://datasheet.ciiva.com/46395/443971-46395125.pdf?src-supplier=Element14; ComponentLink2Description: https://datasheet.ciiva.com/46395/443971-46395125.pdf?src-supplier=Element14; Supplier Part Number 1: 603-RC0603JR-130RL
R2 = CR0402-FX-8872GLF: Res Thick Film 0402 88.7K Ohm 1% 0.063W(1/16W) ±100ppm/C Molded SMD Paper Tape on Plastic Reel; Manufacturer: Bourns; Power Rating: 62.5mW; Resistance: 88.7kR; Voltage Rating: 50V; Temperature Coefficient: 100ppm/°C; Max Power Dissipation: 63mW; Supplier 1: Mouser; Manufacturer Part Number: CR0402-FX-8872GLF; RoHS: Yes; Category: Chip SMD Resistors; Stock 1: 54661; Pricing 1: 1=0,10000, 10=0,02200, 50=0,02200, 100=0,01300, 1000=0,00800, 10000=0,00500 (USD); Mount: Surface Mount; Case/Package: 0402; Case Code (Imperial): 0402; Case Code (Metric): 1005; Contact Plating: Tin; Min Operating Temperature: -55°C; Max Operating Temperature: 125°C; Packaging: Tape and Reel; Package Quantity: 10000; Tolerance: 1%; Resistor Type: Thick Film; Termination: SMD/SMT; Series: CR0402; Number of Terminations: 2; Construction: Rectangular; Length: 1mm; Width: 0.5mm; Height: 0.35mm; Depth: 0.5mm; Thickness: 356um; Radiation Hardening: No; Military Standard: Not; RoHS Compliant: Yes; ComponentLink1URL: http://components.arrow.com/part/dataview/42912538S6478999N1506?src-supplier=Arrow+Electronics; ComponentLink1Description: http://components.arrow.com/part/dataview/42912538S6478999N1506?src-supplier=Arrow+Electronics; ComponentLink2URL: http://www.onlinecomponents.com/datasheet/cr0402-fx-8872glf.aspx?p=10743379&src-supplier=Onlinecomponents.com; ComponentLink2Description: http://www.onlinecomponents.com/datasheet/cr0402-fx-8872glf.aspx?p=10743379&src-supplier=Onlinecomponents.com; ComponentLink3URL: http://components.arrow.com/part/dataview/0323_00459309?src-supplier=Arrow+Europe; ComponentLink3Description: http://components.arrow.com/part/dataview/0323_00459309?src-supplier=Arrow+Europe; ComponentLink4URL: http://www.bourns.com/data/global/pdfs/CR0402.pdf?src-supplier=Mouser; ComponentLink4Description: http://www.bourns.com/data/global/pdfs/CR0402.pdf?src-supplier=Mouser; ComponentLink5URL: https://www.bourns.com/docs/Product-Datasheets/CR0402.pdf?src-supplier=Digi-Key; ComponentLink5Description: https://www.bourns.com/docs/Product-Datasheets/CR0402.pdf?src-supplier=Digi-Key; ComponentLink6URL: http://www.bourns.com/pdfs/CR0402.pdf?src-supplier=Avnet; ComponentLink6Description: http://www.bourns.com/pdfs/CR0402.pdf?src-supplier=Avnet; Supplier Part Number 1: 652-CR0402-FX8872GLF
R3 = CRCW04026M80FKED: VISHAY         CRCW04026M80FKED            SMD Chip Resistor, Thick Film, AEC-Q200 CRCW Series, 6.8 Mohm, 50 V, 0402 [1005 Metric], 63 mW; Resistance: 6.8MR; Power Rating: 63mW; Tolerance: 1%; Voltage Rating: 50V; Temperature Coefficient: 100ppm/°C; Supplier 1: Mouser; Manufacturer: Vishay; Manufacturer Part Number: CRCW04026M80FKED; RoHS: Yes; Category: Chip SMD Resistors; Stock 1: 37640; Pricing 1: 1=0,10000, 10=0,03300, 50=0,03300, 100=0,01400, 1000=0,01300, 10000=0,01000 (USD); Case/Package: 0402; Weight: 2.3E-05oz; Case Code (Metric): 1005; Case Code (Imperial): 0402; Min Operating Temperature: -55°C; Max Operating Temperature: 155°C; Package Quantity: 10000; Packaging: Tape and Reel; Resistor Type: Thick Film; Number of Terminations: 2; Termination: SMD/SMT; Max Power Dissipation: 63mW; Voltage Rating (DC): 50V; Features: Automotive AEC-Q200; Series: CRCW; Resistance Tolerance: 1%; Construction: Rectangular; Length: 1mm; Width: 0.02inch; Height: 0.016inch; Depth: 0.5mm; REACH SVHC: Unknown; Military Standard: Not; Lead Free: Lead Free; RoHS Compliant: Yes; ComponentLink1URL: https://datasheet.ciiva.com/2556/dcrcwe3-2556851.pdf?src-supplier=Digi-Key; ComponentLink1Description: https://datasheet.ciiva.com/2556/dcrcwe3-2556851.pdf?src-supplier=Digi-Key; ComponentLink2URL: https://datasheet.ciiva.com/22682/1700796-22682661.pdf?src-supplier=Element14; ComponentLink2Description: https://datasheet.ciiva.com/22682/1700796-22682661.pdf?src-supplier=Element14; ComponentLink3URL: https://datasheet.ciiva.com/5544/dcrcwe3-109170-5544312.pdf?src-supplier=Mouser; ComponentLink3Description: https://datasheet.ciiva.com/5544/dcrcwe3-109170-5544312.pdf?src-supplier=Mouser; ComponentLink4URL: https://datasheet.ciiva.com/7748/1697337-7748637.pdf?src-supplier=Element14; ComponentLink4Description: https://datasheet.ciiva.com/7748/1697337-7748637.pdf?src-supplier=Element14; ComponentLink5URL: https://datasheet.ciiva.com/7748/1697337-7748638.pdf?src-supplier=Element14; ComponentLink5Description: https://datasheet.ciiva.com/7748/1697337-7748638.pdf?src-supplier=Element14; ComponentLink6URL: https://datasheet.ciiva.com/22702/1697337-22702703.pdf?src-supplier=Element14; ComponentLink6Description: https://datasheet.ciiva.com/22702/1697337-22702703.pdf?src-supplier=Element14; Supplier Part Number 1: 71-CRCW04026M80FKED
R4 = CR0402-FX-1872GLF: RES SMD 18.7K OHM 1% 1/16W 0402; Manufacturer: Bourns; Resistance: 18.7kR; Power Rating: 62.5mW; Voltage Rating: 50V; Temperature Coefficient: 100ppm/°C; Max Power Dissipation: 63mW; Supplier 1: Mouser; Manufacturer Part Number: CR0402-FX-1872GLF; RoHS: Yes; Category: Chip SMD Resistors; Stock 1: 45190; Pricing 1: 1=0,12000, 10=0,02600, 50=0,02600, 100=0,01500, 1000=0,01000, 10000=0,00600 (USD); Mount: Surface Mount; Case/Package: 0402; Case Code (Imperial): 0402; Case Code (Metric): 1005; Contact Plating: Tin; Min Operating Temperature: -55°C; Max Operating Temperature: 125°C; Packaging: Tape and Reel; Tolerance: 1%; Package Quantity: 10000; Resistor Type: Thick Film; Termination: SMD/SMT; Series: CR0402; Number of Terminations: 2; Length: 1mm; Width: 0.5mm; Height: 0.35mm; Thickness: 356um; Radiation Hardening: No; RoHS Compliant: Yes; ComponentLink1URL: http://components.arrow.com/part/dataview/41911102S5605434N1506?src-supplier=Arrow+Electronics; ComponentLink1Description: http://components.arrow.com/part/dataview/41911102S5605434N1506?src-supplier=Arrow+Electronics; ComponentLink2URL: http://www.onlinecomponents.com/datasheet/cr0402-fx-1872glf.aspx?p=10742862&src-supplier=Onlinecomponents.com; ComponentLink2Description: http://www.onlinecomponents.com/datasheet/cr0402-fx-1872glf.aspx?p=10742862&src-supplier=Onlinecomponents.com; ComponentLink3URL: http://www.bourns.com/pdfs/CR0402.pdf?src-supplier=Avnet; ComponentLink3Description: http://www.bourns.com/pdfs/CR0402.pdf?src-supplier=Avnet; ComponentLink4URL: http://www.bourns.com/data/global/pdfs/CR0402.pdf?src-supplier=Mouser; ComponentLink4Description: http://www.bourns.com/data/global/pdfs/CR0402.pdf?src-supplier=Mouser; ComponentLink5URL: https://www.bourns.com/docs/Product-Datasheets/CR0402.pdf?src-supplier=Digi-Key; ComponentLink5Description: https://www.bourns.com/docs/Product-Datasheets/CR0402.pdf?src-supplier=Digi-Key; Supplier Part Number 1: 652-CR0402-FX1872GLF
R5 = AC0402FR-071M3L: RES SMD 1.3M OHM 1% 1/16W 0402; Manufacturer: Yageo; Resistance: 1.3MR; Max Power Dissipation: 63mW; Temperature Coefficient: 100ppm/°C; Supplier 1: Mouser; Manufacturer Part Number: AC0402FR-071M3L; RoHS: Yes; Category: Chip SMD Resistors; Stock 1: 49532; Pricing 1: 1=0,10000, 10=0,01700, 50=0,01700, 100=0,00600, 1000=0,00500, 10000=0,00300 (USD); Case/Package: 0402; Min Operating Temperature: -55°C; Max Operating Temperature: 155°C; Packaging: Tape and Reel; Resistor Type: Thick Film; Number of Terminations: 2; Tolerance: 1%; Features: Moisture Resistant,Automotive AEC-Q200; Length: 0.039inch; Width: 0.02inch; Height: 0.015inch; RoHS Compliant: Yes; ComponentLink1URL: http://www.yageo.com/NewPortal/yageodocoutput?fileName=/pdf/R-Chip/PYu-AC_51_RoHS_L_6.pdf&src-supplier=Digi-Key; ComponentLink1Description: http://www.yageo.com/NewPortal/yageodocoutput?fileName=/pdf/R-Chip/PYu-AC_51_RoHS_L_6.pdf&src-supplier=Digi-Key; Supplier Part Number 1: 603-AC0402FR-071M3L
R6 = CRCW040222K1FKED: Resistor;  Thick Film;  22.1 Kilohms;  0.063 W;  1%;  SMT;  0402;  TCR 37 ppm/DegC;  TR; Manufacturer: Vishay; Resistance: 22.1kR; Temperature Coefficient: 100ppm/°C; Max Power Dissipation: 63mW; Voltage Rating: 50V; Supplier 1: Mouser; Manufacturer Part Number: CRCW040222K1FKED; RoHS: Yes; Category: Chip SMD Resistors; Stock 1: 53617; Pricing 1: 1=0,10000, 10=0,03300, 50=0,03300, 100=0,01400, 1000=0,00500, 10000=0,00500 (USD); Mount: Surface Mount; Case/Package: 0402; Number of Pins: 2; Case Code (Imperial): 0402; Case Code (Metric): 1005; Contact Plating: Tin; Weight: 2.3E-05oz; Min Operating Temperature: -55°C; Max Operating Temperature: 155°C; Tolerance: 1%; Packaging: Tape and Reel; Resistor Type: Thick Film; Number of Terminations: 2; Package Quantity: 10000; Features: Automotive AEC-Q200; Series: CRCW; Power Rating: 63mW; Termination: SMD/SMT; Voltage Rating (DC): 50V; Working Voltage: 50V; Resistance Tolerance: 1%; Construction: Rectangular; Technology: THICK FILM; Length: 1mm; Width: 0.5mm; Height: 0.35mm; Depth: 0.5mm; Radiation Hardening: No; RoHS Compliant: Yes; Lead Free: Lead Free; REACH SVHC: Unknown; Military Standard: Not; ComponentLink1URL: https://datasheet.ciiva.com/11810/0900766b80d98824-11810184.pdf?src-supplier=RSComponents; ComponentLink1Description: https://datasheet.ciiva.com/11810/0900766b80d98824-11810184.pdf?src-supplier=RSComponents; ComponentLink2URL: https://datasheet.ciiva.com/7673/1697337-7673445.pdf?src-supplier=Element14; ComponentLink2Description: https://datasheet.ciiva.com/7673/1697337-7673445.pdf?src-supplier=Element14; ComponentLink3URL: https://datasheet.ciiva.com/3256/dcrcwe3-3256246.pdf?src-supplier=Avnet; ComponentLink3Description: https://datasheet.ciiva.com/3256/dcrcwe3-3256246.pdf?src-supplier=Avnet; ComponentLink4URL: https://datasheet.ciiva.com/3256/dcrcwe3-3256247.pdf?src-supplier=Avnet; ComponentLink4Description: https://datasheet.ciiva.com/3256/dcrcwe3-3256247.pdf?src-supplier=Avnet; ComponentLink5URL: https://datasheet.ciiva.com/16208/dcrcwe3-16208744.pdf?src-supplier=Future+Electronics; ComponentLink5Description: https://datasheet.ciiva.com/16208/dcrcwe3-16208744.pdf?src-supplier=Future+Electronics; ComponentLink6URL: https://datasheet.ciiva.com/22871/70201119-22871080.pdf?src-supplier=Allied+Electronics; ComponentLink6Description: https://datasheet.ciiva.com/22871/70201119-22871080.pdf?src-supplier=Allied+Electronics; ComponentLink7URL: https://datasheet.ciiva.com/16886/dcrcwe3-16886652.pdf?src-supplier=Avnet+Europe; ComponentLink7Description: https://datasheet.ciiva.com/16886/dcrcwe3-16886652.pdf?src-supplier=Avnet+Europe; ComponentLink8URL: https://datasheet.ciiva.com/7673/1697337-7673245.pdf?src-supplier=Element14; ComponentLink8Description: https://datasheet.ciiva.com/7673/1697337-7673245.pdf?src-supplier=Element14; ComponentLink9URL: https://datasheet.ciiva.com/16771/70201119-16771838.pdf?src-supplier=Allied+Electronics; ComponentLink9Description: https://datasheet.ciiva.com/16771/70201119-16771838.pdf?src-supplier=Allied+Electronics; Supplier Part Number 1: 71-CRCW0402-22.1K-E3
R7 = CRCW0402-10K0FKED: Res Thick Film 0402 10K Ohm 1% 1/16W ±100ppm/°C Molded SMD Paper T/R; Manufacturer: Vishay; Power Rating: 63mW; Resistance: 10kR; Voltage Rating: 50V; Supplier 1: Mouser; Manufacturer Part Number: CRCW0402-10K0FKED; RoHS: Yes; Category: Chip SMD Resistors; Stock 1: 1711719; Pricing 1: 1=0,100000, 10=0,033000, 50=0,033000, 100=0,014000, 1000=0,006000, 10000=0,005000 (USD); Mount: Surface Mount; Case/Package: 0402; Number of Pins: 2; Contact Plating: Tin; Weight: 2.3E-05oz; Case Code (Metric): 1005; Case Code (Imperial): 0402; Min Operating Temperature: -55°C; Max Operating Temperature: 155°C; Tolerance: 1%; Resistor Type: Thick Film; Temperature Coefficient: 100ppm/°C; Termination: SMD/SMT; Package Quantity: 10; Packaging: Tape and Reel; Number of Terminations: 2; Max Power Dissipation: 63mW; Voltage Rating (DC): 50V; Features: Automotive AEC-Q200; Length: 1mm; Width: 0.02inch; Height: 0.35mm; Depth: 0.5mm; Radiation Hardening: No; Lead Free: Lead Free; REACH SVHC: Unknown; Military Standard: Not; ComponentLink1URL: https://datasheet.ciiva.com/11809/0900766b80d98824-11809984.pdf?src-supplier=RSComponents; ComponentLink1Description: https://datasheet.ciiva.com/11809/0900766b80d98824-11809984.pdf?src-supplier=RSComponents; ComponentLink2URL: https://datasheet.ciiva.com/2463/dcrcwe3-2463025.pdf?src-supplier=Digi-Key; ComponentLink2Description: https://datasheet.ciiva.com/2463/dcrcwe3-2463025.pdf?src-supplier=Digi-Key; ComponentLink3URL: https://datasheet.ciiva.com/2463/dcrcwe3-2463026.pdf?src-supplier=Digi-Key; ComponentLink3Description: https://datasheet.ciiva.com/2463/dcrcwe3-2463026.pdf?src-supplier=Digi-Key; ComponentLink4URL: https://datasheet.ciiva.com/2463/dcrcwe3-2463027.pdf?src-supplier=Digi-Key; ComponentLink4Description: https://datasheet.ciiva.com/2463/dcrcwe3-2463027.pdf?src-supplier=Digi-Key; ComponentLink5URL: https://datasheet.ciiva.com/46385/1697337-46385560.pdf?src-supplier=Element14; ComponentLink5Description: https://datasheet.ciiva.com/46385/1697337-46385560.pdf?src-supplier=Element14; ComponentLink6URL: https://datasheet.ciiva.com/3255/dcrcwe3-3255961.pdf?src-supplier=Avnet; ComponentLink6Description: https://datasheet.ciiva.com/3255/dcrcwe3-3255961.pdf?src-supplier=Avnet; ComponentLink7URL: https://datasheet.ciiva.com/3255/dcrcwe3-3255962.pdf?src-supplier=Avnet; ComponentLink7Description: https://datasheet.ciiva.com/3255/dcrcwe3-3255962.pdf?src-supplier=Avnet; ComponentLink8URL: https://datasheet.ciiva.com/5547/dcrcwe3-109170-5547786.pdf?src-supplier=Mouser; ComponentLink8Description: https://datasheet.ciiva.com/5547/dcrcwe3-109170-5547786.pdf?src-supplier=Mouser; ComponentLink9URL: https://datasheet.ciiva.com/26316/fld-crcw-e3-data-en-26316618.pdf?src-supplier=Distrelec; ComponentLink9Description: https://datasheet.ciiva.com/26316/fld-crcw-e3-data-en-26316618.pdf?src-supplier=Distrelec; ComponentLink10URL: https://datasheet.ciiva.com/16208/dcrcwe3-16208525.pdf?src-supplier=Future+Electronics; ComponentLink10Description: https://datasheet.ciiva.com/16208/dcrcwe3-16208525.pdf?src-supplier=Future+Electronics; ComponentLink11URL: https://datasheet.ciiva.com/36856/1720486-36856909.pdf?src-supplier=Element14; ComponentLink11Description: https://datasheet.ciiva.com/36856/1720486-36856909.pdf?src-supplier=Element14; Supplier Part Number 1: 71-CRCW0402-10K-E3
R8 = CRCW040218K0FKED: RESISTOR, 0402, 18K, 1%, FULL REEL; Product Range:VISHAY - AEC-Q200 CRCW Series; Resistance:18kohm; Power Rating:63mW; Resistance Tolerance:± 1%; Resistor Case Style:0402 [1005 Metric]; Resistor Element Material:Thick Film; ;RoHS Compliant: Yes; Manufacturer: Vishay; Resistance: 18kR; Power Rating: 63mW; Voltage Rating: 50V; Temperature Coefficient: 100ppm/°C; Supplier 1: Mouser; Manufacturer Part Number: CRCW040218K0FKED; RoHS: Yes; Category: Chip SMD Resistors; Stock 1: 36601; Pricing 1: 1=0,10000, 10=0,03300, 50=0,03300, 100=0,01400, 1000=0,00500, 10000=0,00500 (USD); Case/Package: 0402; Number of Pins: 2; Case Code (Imperial): 0402; Case Code (Metric): 1005; Contact Plating: Tin; Weight: 2.3E-05oz; Size Code: 0402; Min Operating Temperature: -55°C; Max Operating Temperature: 155°C; Tolerance: 1%; Packaging: Tape and Reel; Package Quantity: 10000; Resistor Type: Thick Film; Termination: SMD/SMT; Voltage Rating (DC): 50V; Features: Automotive AEC-Q200; Series: CRCW; Max Power Dissipation: 63mW; Number of Terminations: 2; Resistance Tolerance: 1%; Technology: THICK FILM; Construction: Rectangular; Length: 1mm; Width: 0.5mm; Height: 0.35mm; Depth: 0.5mm; Radiation Hardening: No; Lead Free: Lead Free; REACH SVHC: Unknown; Military Standard: Not; RoHS Compliant: Yes; ComponentLink1URL: https://datasheet.ciiva.com/11818/0900766b80d98824-11818010.pdf?src-supplier=RSComponents; ComponentLink1Description: https://datasheet.ciiva.com/11818/0900766b80d98824-11818010.pdf?src-supplier=RSComponents; ComponentLink2URL: https://datasheet.ciiva.com/16881/dcrcwe3-16881016.pdf?src-supplier=Avnet+Europe; ComponentLink2Description: https://datasheet.ciiva.com/16881/dcrcwe3-16881016.pdf?src-supplier=Avnet+Europe; ComponentLink3URL: https://datasheet.ciiva.com/22708/1697337-22708409.pdf?src-supplier=Element14; ComponentLink3Description: https://datasheet.ciiva.com/22708/1697337-22708409.pdf?src-supplier=Element14; ComponentLink4URL: https://datasheet.ciiva.com/7841/1697337-7841482.pdf?src-supplier=Element14; ComponentLink4Description: https://datasheet.ciiva.com/7841/1697337-7841482.pdf?src-supplier=Element14; ComponentLink5URL: https://datasheet.ciiva.com/7841/1697337-7841483.pdf?src-supplier=Element14; ComponentLink5Description: https://datasheet.ciiva.com/7841/1697337-7841483.pdf?src-supplier=Element14; ComponentLink6URL: https://datasheet.ciiva.com/16773/70201119-16773931.pdf?src-supplier=Allied+Electronics; ComponentLink6Description: https://datasheet.ciiva.com/16773/70201119-16773931.pdf?src-supplier=Allied+Electronics; ComponentLink7URL: https://datasheet.ciiva.com/7743/125364-7743469.pdf?src-supplier=Element14; ComponentLink7Description: https://datasheet.ciiva.com/7743/125364-7743469.pdf?src-supplier=Element14; ComponentLink8URL: https://datasheet.ciiva.com/26316/fld-crcw-e3-data-en-26316621.pdf?src-supplier=Distrelec; ComponentLink8Description: https://datasheet.ciiva.com/26316/fld-crcw-e3-data-en-26316621.pdf?src-supplier=Distrelec